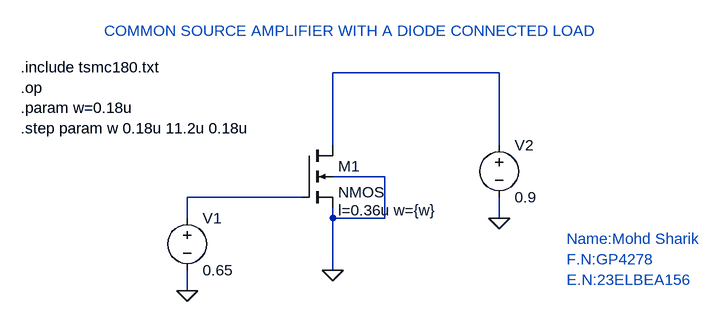
[diagram p0: schematic COMMON SOURCE AMPLIFIER WITH A DIODE CONNECTED LOAD1.asc]
COMMON SOURCE AMPLIFIER WITH A DIODE CONNECTED LOAD1.asc, the LTspice schematic file:
Version 4
SHEET 1 880 680
WIRE 464 0 208 0
WIRE 208 112 208 0
WIRE 464 112 464 0
WIRE 288 160 208 160
WIRE 160 192 -16 192
WIRE -16 224 -16 192
WIRE 208 224 208 208
WIRE 288 224 288 160
WIRE 288 224 208 224
WIRE 464 224 464 192
WIRE 208 304 208 224
WIRE -16 336 -16 304
FLAG -16 336 0
FLAG 464 224 0
FLAG 208 304 0
SYMBOL nmos4 160 112 R0
WINDOW 123 56 100 Left 2
SYMATTR Value2 l=0.36u w={w}
SYMATTR InstName M1
SYMBOL voltage -16 208 R0
WINDOW 123 0 0 Left 0
WINDOW 39 0 0 Left 0
SYMATTR InstName V1
SYMATTR Value 0.65
SYMBOL voltage 464 96 R0
WINDOW 123 0 0 Left 0
WINDOW 39 0 0 Left 0
SYMATTR InstName V2
SYMATTR Value 0.9
TEXT -272 -8 Left 2 !.include tsmc180.txt\n.op\n.param w=0.18u\n.step param w 0.18u 11.2u 0.18u
TEXT -144 -64 Left 2 ;COMMON SOURCE AMPLIFIER WITH A DIODE CONNECTED LOAD
TEXT 568 256 Left 2 ;Name:Mohd Sharik\nF.N:GP4278\nE.N:23ELBEA156

The netlist it stands for:
* COMMON SOURCE AMPLIFIER WITH A DIODE CONNECTED LOAD1.asc
M1 N001 N002 0 0 NMOS l=0.36u w={w}
V1 N002 0 0.65
V2 N001 0 0.9
.model NMOS NMOS
.model PMOS PMOS
.lib standard.mos
.include tsmc180.txt
.op
.param w=0.18u
.step param w 0.18u 11.2u 0.18u
* COMMON SOURCE AMPLIFIER WITH A DIODE CONNECTED LOAD
* Name:Mohd Sharik
* F.N:GP4278
* E.N:23ELBEA156
.backanno
.end